# Altium schematic sheet PS2_INT.SchDoc: LiveDesign Evaluation - EvalBoard Tester
size A4; Organization: Altium Limited; Address1: L3, 12a Rodborough Rd; Address2: Frenchs Forest; Address3: NSW; Address4: Australia 2086; DocumentNumber: 4; SheetNumber: 4; SheetTotal: 16
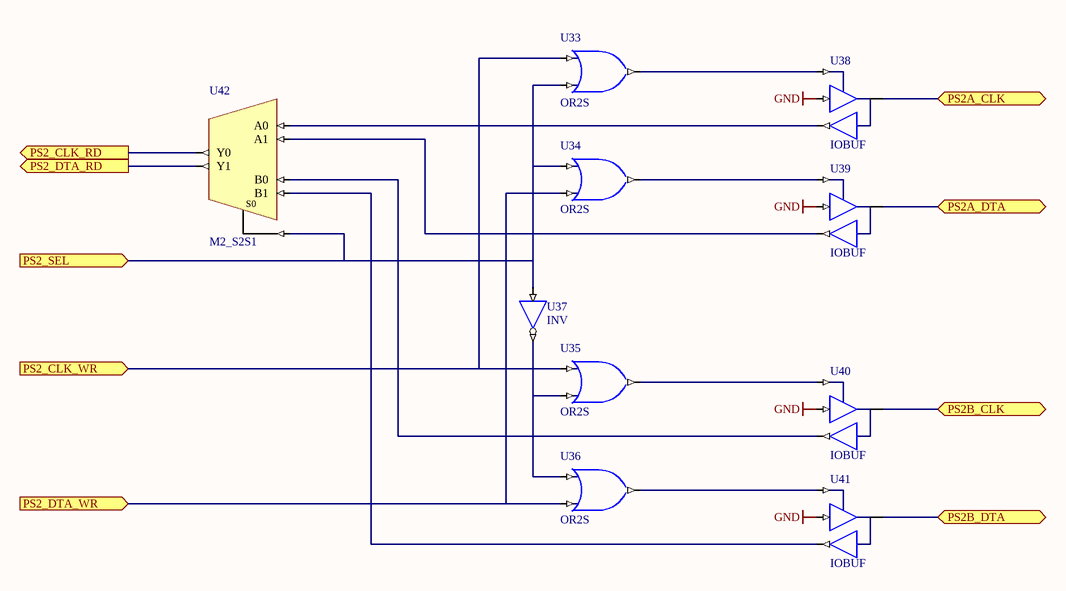
[diagram p0: PS2_INT.SchDoc]

## Parts
U33  OR2S
U34  OR2S
U35  OR2S
U36  OR2S
U37  INV
U38  IOBUF
U39  IOBUF
U40  IOBUF
U41  IOBUF
U42  M2_S2S1

## Ports
PS2_CLK_RD (out), PS2_CLK_WR (in), PS2_DTA_RD (out), PS2_DTA_WR (in), PS2_SEL (in), PS2A_CLK (bidir), PS2A_DTA (bidir), PS2B_CLK (bidir), PS2B_DTA (bidir)

## Nets
GND: U38.I U39.I U40.I U41.I
PS2_CLK_RD: U42.Y0 ; port PS2_CLK_RD
PS2_CLK_WR: U33.I0 U35.I0 ; port PS2_CLK_WR
PS2_DTA_RD: U42.Y1 ; port PS2_DTA_RD
PS2_DTA_WR: U34.I1 U36.I1 ; port PS2_DTA_WR
PS2_SEL: U33.I1 U34.I0 U37.I U42.S0 ; port PS2_SEL
PS2A_CLK: U38.IO ; port PS2A_CLK
PS2A_DTA: U39.IO ; port PS2A_DTA
PS2B_CLK: U40.IO ; port PS2B_CLK
PS2B_DTA: U41.IO ; port PS2B_DTA
NetU33_O: U33.O U38.T
NetU34_O: U34.O U39.T
NetU35_I1: U35.I1 U36.I0 U37.O
NetU35_O: U35.O U40.T
NetU36_O: U36.O U41.T
NetU38_O: U38.O U42.A0
NetU39_O: U39.O U42.A1
NetU40_O: U40.O U42.B0
NetU41_O: U41.O U42.B1

## Notes on the sheet
- Title
- Size:
- Date:
- A4
- Number:
- Time:
- Revision:
- Sheet
- of
- File:

## Library data of the parts
U33-U36 = OR2S: 2-Input OR Gate, Single Pin Version; Xilinx Equivalent: OR2; ArchiveName: GENERIC; VHDLIB_SIM: GENERIC_LIB; Published: 29-Jan-2004; Publisher: Altium Limited; Core Revision: 1.00.00
U37 = INV: Inverter; ArchiveName: GENERIC; VHDLIB_SIM: GENERIC_LIB; Published: 29-Jan-2004; Publisher: Altium Limited; Xilinx Equivalent: INV; Core Revision: 1.00.00
U38-U41 = IOBUF: Input/Output Buffer; ArchiveName: GENERIC; VHDLIB_SIM: GENERIC_LIB; Published: 29-Jan-2004; Publisher: Altium Limited; Xilinx Equivalent: IOBUF; Core Revision: 1.00.00
U42 = M2_S2S1: 2x2-Single Wire to 1x2-Single Wire Multiplexer; ArchiveName: GENERIC; VHDLIB_SIM: GENERIC_LIB; Published: 29-Jan-2004; Publisher: Altium Limited; Core Revision: 1.00.00